# EAGLE design Pololu Magnetic Encoder (EAGLE 6.1)
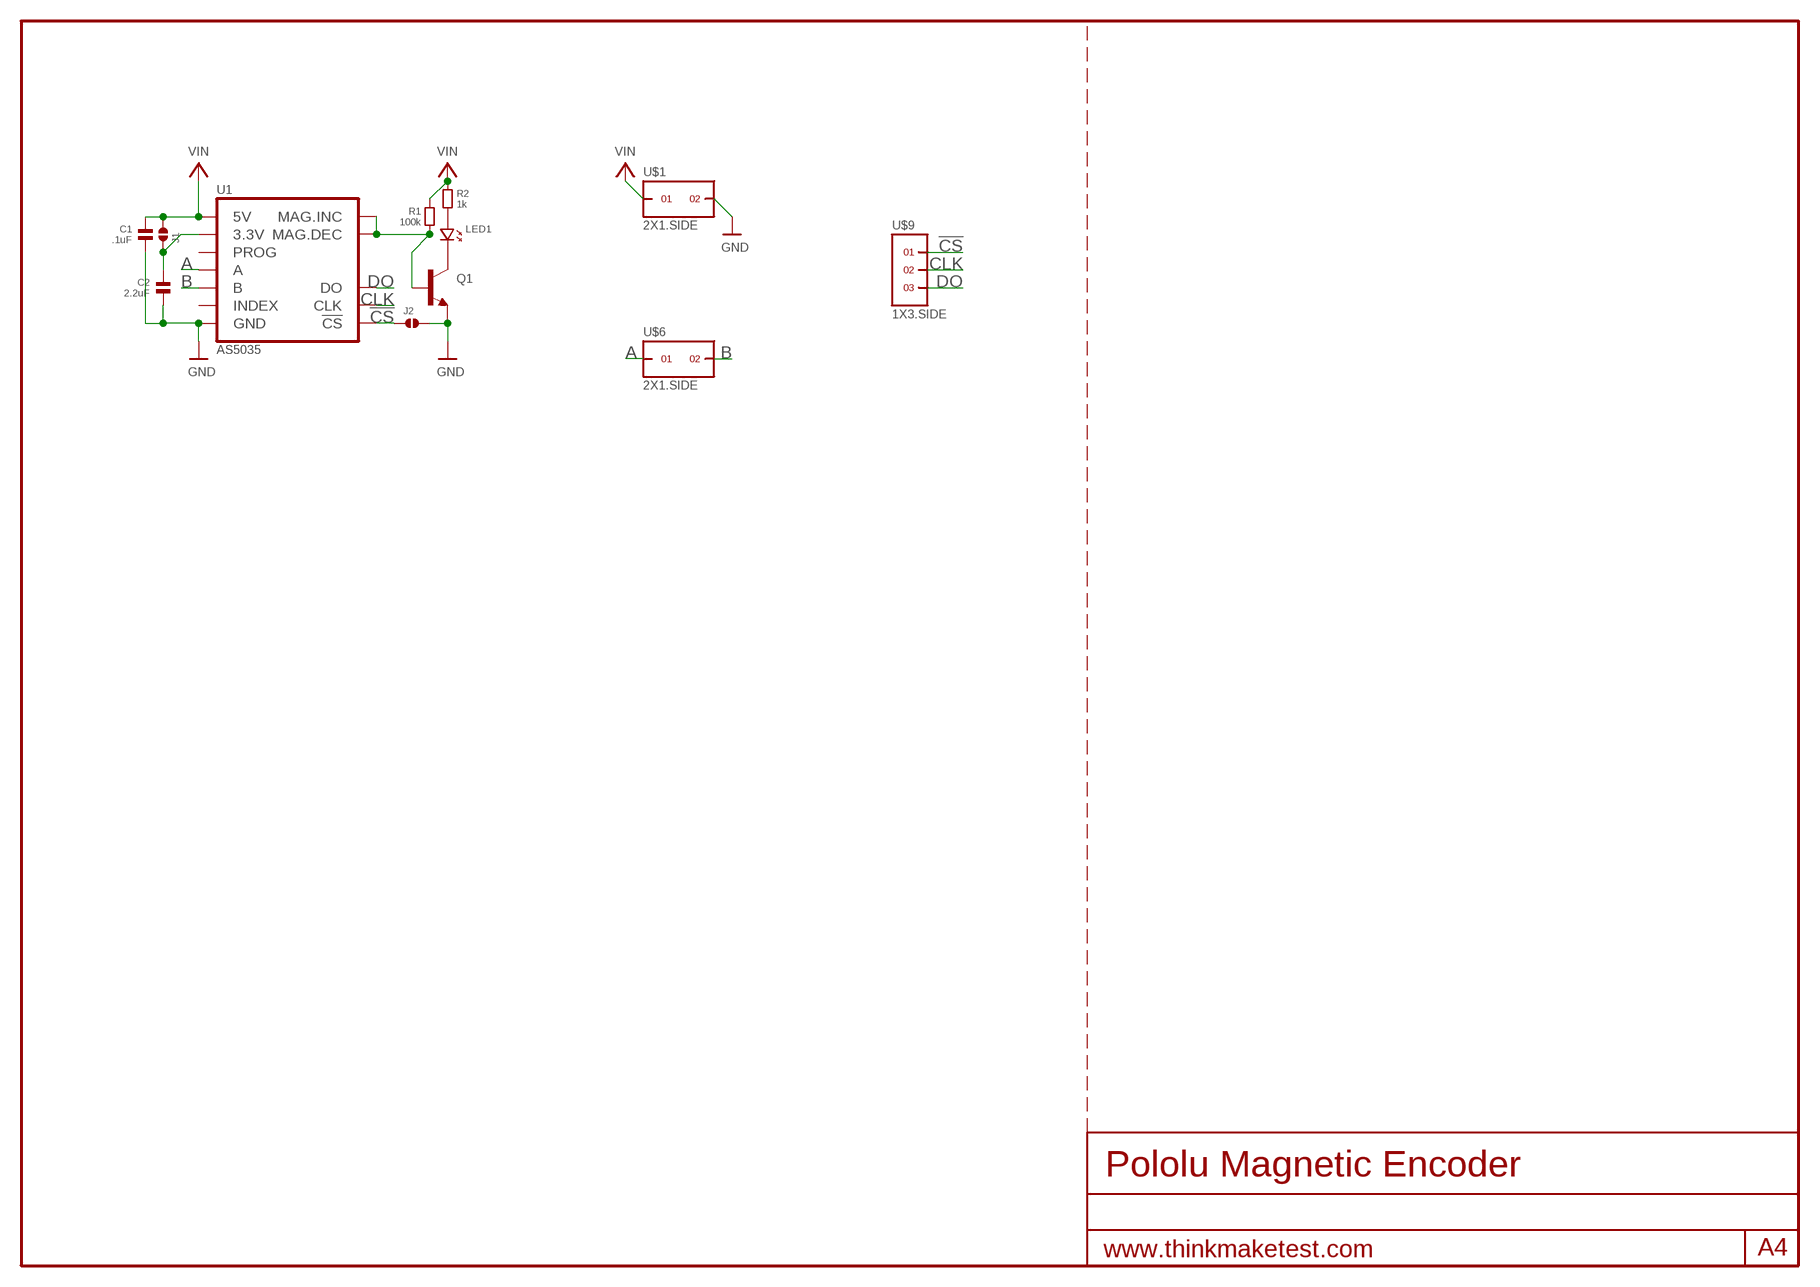
[diagram p0: schematic, sheet 1]

## Parts
C1  .1uF  CAPACITOR.0603  [0603]
C2  2.2uF  CAPACITOR.0603  [0603]
J1  SOLDERJUMPER.2.LRG.PASTE  [2.LRG.PASTE]
J2  SOLDERJUMPER.2.LRG.PASTE  [2.LRG.PASTE]
LED1  LED.0603  [0603.LED]
Q1  TRANSISTOR_NPN  [SOT23-R]
R1  100k  RESISTOR.0603  [0603]
R2  1k  RESISTOR.0603  [0603]
U1  AS5035  [SSOP16]
U$1  2X1.SIDE  [2X1.SIDE]
U$6  2X1.SIDE  [2X1.SIDE]
U$9  1X3.SIDE  [1X3.SIDE]

## Nets
!CS: J2.1 U1.11(!CS) U$9.1
A: U1.3(A) U$6.1
B: U1.4(B) U$6.2
CLK: U1.10(CLK) U$9.2
DO: U1.9(DO) U$9.3
GND: C1.2 C2.2 J2.2 Q1.2(E) U1.7(GND) U$1.2
N$1: LED1.P$2 Q1.3(C)
N$2: LED1.P$1 R2.2
N$3: Q1.1(B) R1.2 U1.1(MAG.INC) U1.2(MAG.DEC)
N$4: C2.1 J1.1 U1.15(3.3V)
VIN: C1.1 J1.2 R1.1 R2.1 U1.16(5V) U$1.1
Unconnected: U1.6(INDEX) U1.8(PROG)

## Library data of the parts
C1 C2 = .standardparts:CAPACITOR
J1 J2 = .solderjumper:SOLDERJUMPER.2
LED1 = .standardparts:LED
Q1 = microbuilder:TRANSISTOR_NPN: NPN Transistor Transistor (NPN) 500mA 45V - BC817 [Digikey: 568-1631-1-ND] SOT23-R - SOT23 footprint optimised for use with solder paste and reflow ovens. SOT23-W - SOT23 footprint optimised for hand-soldering (larger pads).
R1 R2 = .standardparts:RESISTOR
U1 = austriamicrosystems:AS5035
U$1 U$6 = .standardheaders:2X1
U$9 = .standardheaders:1X3

## Board
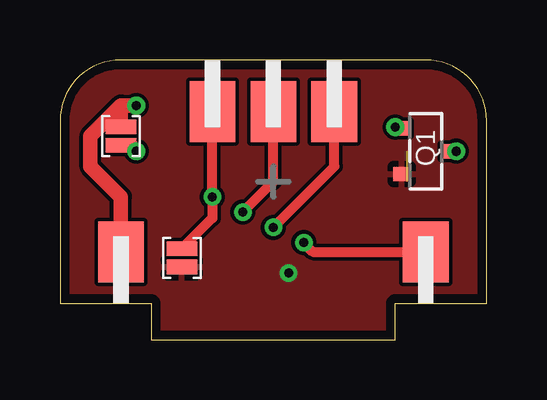
[diagram p1: board, top side]
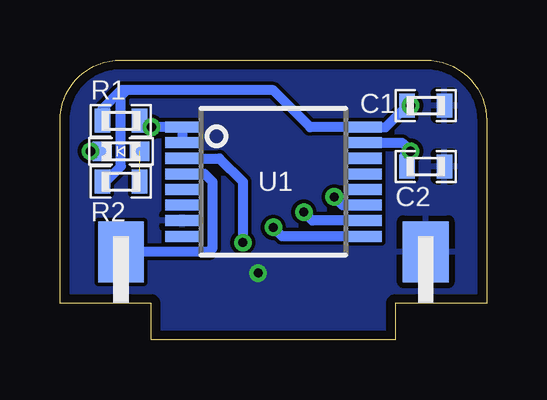
[diagram p2: board, bottom side, seen from below]

Size 17.78 x 11.68 mm. Coordinates in mm from the lower left corner, seen from the top.
Outline: 0,1.52 3.81,1.52 3.81,0 13.97,0 13.97,1.52 17.78,1.52 17.78,9.14 arc90 15.24,11.68 2.54,11.68 arc90 0,9.14 0,1.52
Copper layers (1*16): Top 0.0356mm / dielectric 1.5011mm / Bottom 0.0356mm
Design rules: minimum track width 6mil, minimum drill 13mil, track to track 6mil, track to pad 6mil, pad to pad 6mil, via to via 6mil, smd to smd 6mil, copper to edge 15mil, drill to drill 6mil, minimum pad ring 7mil, minimum via ring 7mil, stop-mask expansion 4mil, vias tented up to drill 16mil, thermal gap 10mil

### Footprints (pad centres in the part's own frame; a part is rotated, then mirrored left to right if it is on the bottom)
0603 = smd 0.65 x 1: 1 -0.775,0; 2 0.775,0
2.LRG.PASTE = smd 0.61 x 1.27: 1 -0.381,0; 2 0.381,0
0603.LED = smd 0.8 x 0.8: P$1 -0.775,0; P$2 0.775,0
SOT23-R = smd 0.6 x 0.7: 1 -0.95,-1; 2 0.95,-1; 3 0,1
SSOP16 = smd 0.46 x 1.43: 1 -2.275,-3.795; 2 -1.625,-3.795; 3 -0.975,-3.795; 4 -0.325,-3.795; 5 0.325,-3.795; 6 0.975,-3.795; 7 1.625,-3.795; 8 2.275,-3.795; 9 2.275,3.795; 10 1.625,3.795; 11 0.975,3.795; 12 0.325,3.795; 13 -0.325,3.795; 14 -0.975,3.795; 15 -1.625,3.795; 16 -2.275,3.795
2X1.SIDE = smd 1.905 x 2.54: 1 0,-2.159 | smd 1.905 x 2.54 bottom: 2 0,-2.159
1X3.SIDE = smd 1.905 x 2.54: 1 -2.54,-2.159; 2 0,-2.159; 3 2.54,-2.159

### Placement (x,y rotation side)
C1  2.54,9.78 0 bottom
C2  2.54,7.24 0 bottom
J1  2.54,8.51 90 top
J2  5.08,3.43 270 top
LED1  15.24,7.87 180 bottom
Q1  15.24,7.87 270 top
R1  15.24,9.14 0 bottom
R2  15.24,6.6 0 bottom
U1  8.89,6.6 270 bottom
U$1  2.54,1.52 180 top
U$6  15.24,1.52 180 top
U$9  8.89,11.68 0 top

### Tracks (layer width: path | path; a pad name or v marks a point on that pad's centre or on a via)
!CS  (via drill 0.38)
  Top 0.406: U$9.1 v6.35,5.97 6.35,5.08 J2.1
  Bottom 0.406: U1.11 6.01,5.63 v6.35,5.97
A  (via drill 0.38)
  Top 0.406: v10.16,4.06 10.54,3.68 U$6.1
  Bottom 0.406: U1.3 11.13,7.58 10.16,6.6 v10.16,4.06
B
  Bottom 0.406: U1.4 11.76,6.93 11.43,6.6 11.43,3.82 11.57,3.68 U$6.2
CLK  (via drill 0.38)
  Top 0.406: v7.62,5.33 8.89,6.6 U$9.2
  Bottom 0.406: U1.10 7.26,4.98 v7.62,5.33
DO  (via drill 0.38)
  Top 0.406: v8.89,4.7 11.43,7.24 U$9.3
  Bottom 0.406: U1.9 8.52,4.33 v8.89,4.7
GND  (via drill 0.38)
  other vias: 9.53,2.79
  pour Bottom (rank 6): 0,0 17.78,0 17.78,11.68 0,11.68
  pour Top (rank 6): 0,0 17.78,0 17.78,11.68 0,11.68
N$1  (via drill 0.38)
  Top 0.406: Q1.3 v16.51,7.87
  Bottom 0.406: v16.51,7.87 LED1.P$2
N$2  (1 unrouted)
N$3  (via drill 0.38)
  Top 0.406: Q1.1 14.03,8.82 v13.97,8.88
  Bottom 0.406: U1.2 U1.1 v13.97,8.88 14.2,8.88 R1.2
N$4  (via drill 0.38)
  Top 0.61: J1.1 2.92,8.13 v3.17,7.87
  Bottom 0.406: U1.15 3.53,8.23 v3.17,7.87
  Bottom 0.61: v3.17,7.87 3.31,7.73 C2.1
VIN  (via drill 0.38)
  Top 0.61: v3.17,9.78 2.54,9.78 2.41,9.65 | 2.41,9.65 1.27,8.51 1.27,7.24 2.54,5.97 U$1.1 | J1.2 2.54,9.53 2.41,9.65
  Bottom 0.406: C1.1 4.21,8.88 U1.16 7.36,8.88 8.89,10.41 15,10.41 | R2.1 15.88,6.6 15.24,7.24 15.24,10.17 15,10.41 | 15,10.41 15.24,10.41 16.02,9.64 R1.1
  Bottom 0.61: v3.17,9.78 C1.1

### Text on the board
tDocu: 3.3v | !SPI | ThinkMakeTest
bDocu: DO | CLK | !CS | Cruz Monrreal II | 4-Mar-2012